# EAGLE design NODEMCU_ESP8266 (EAGLE 7.6.0)
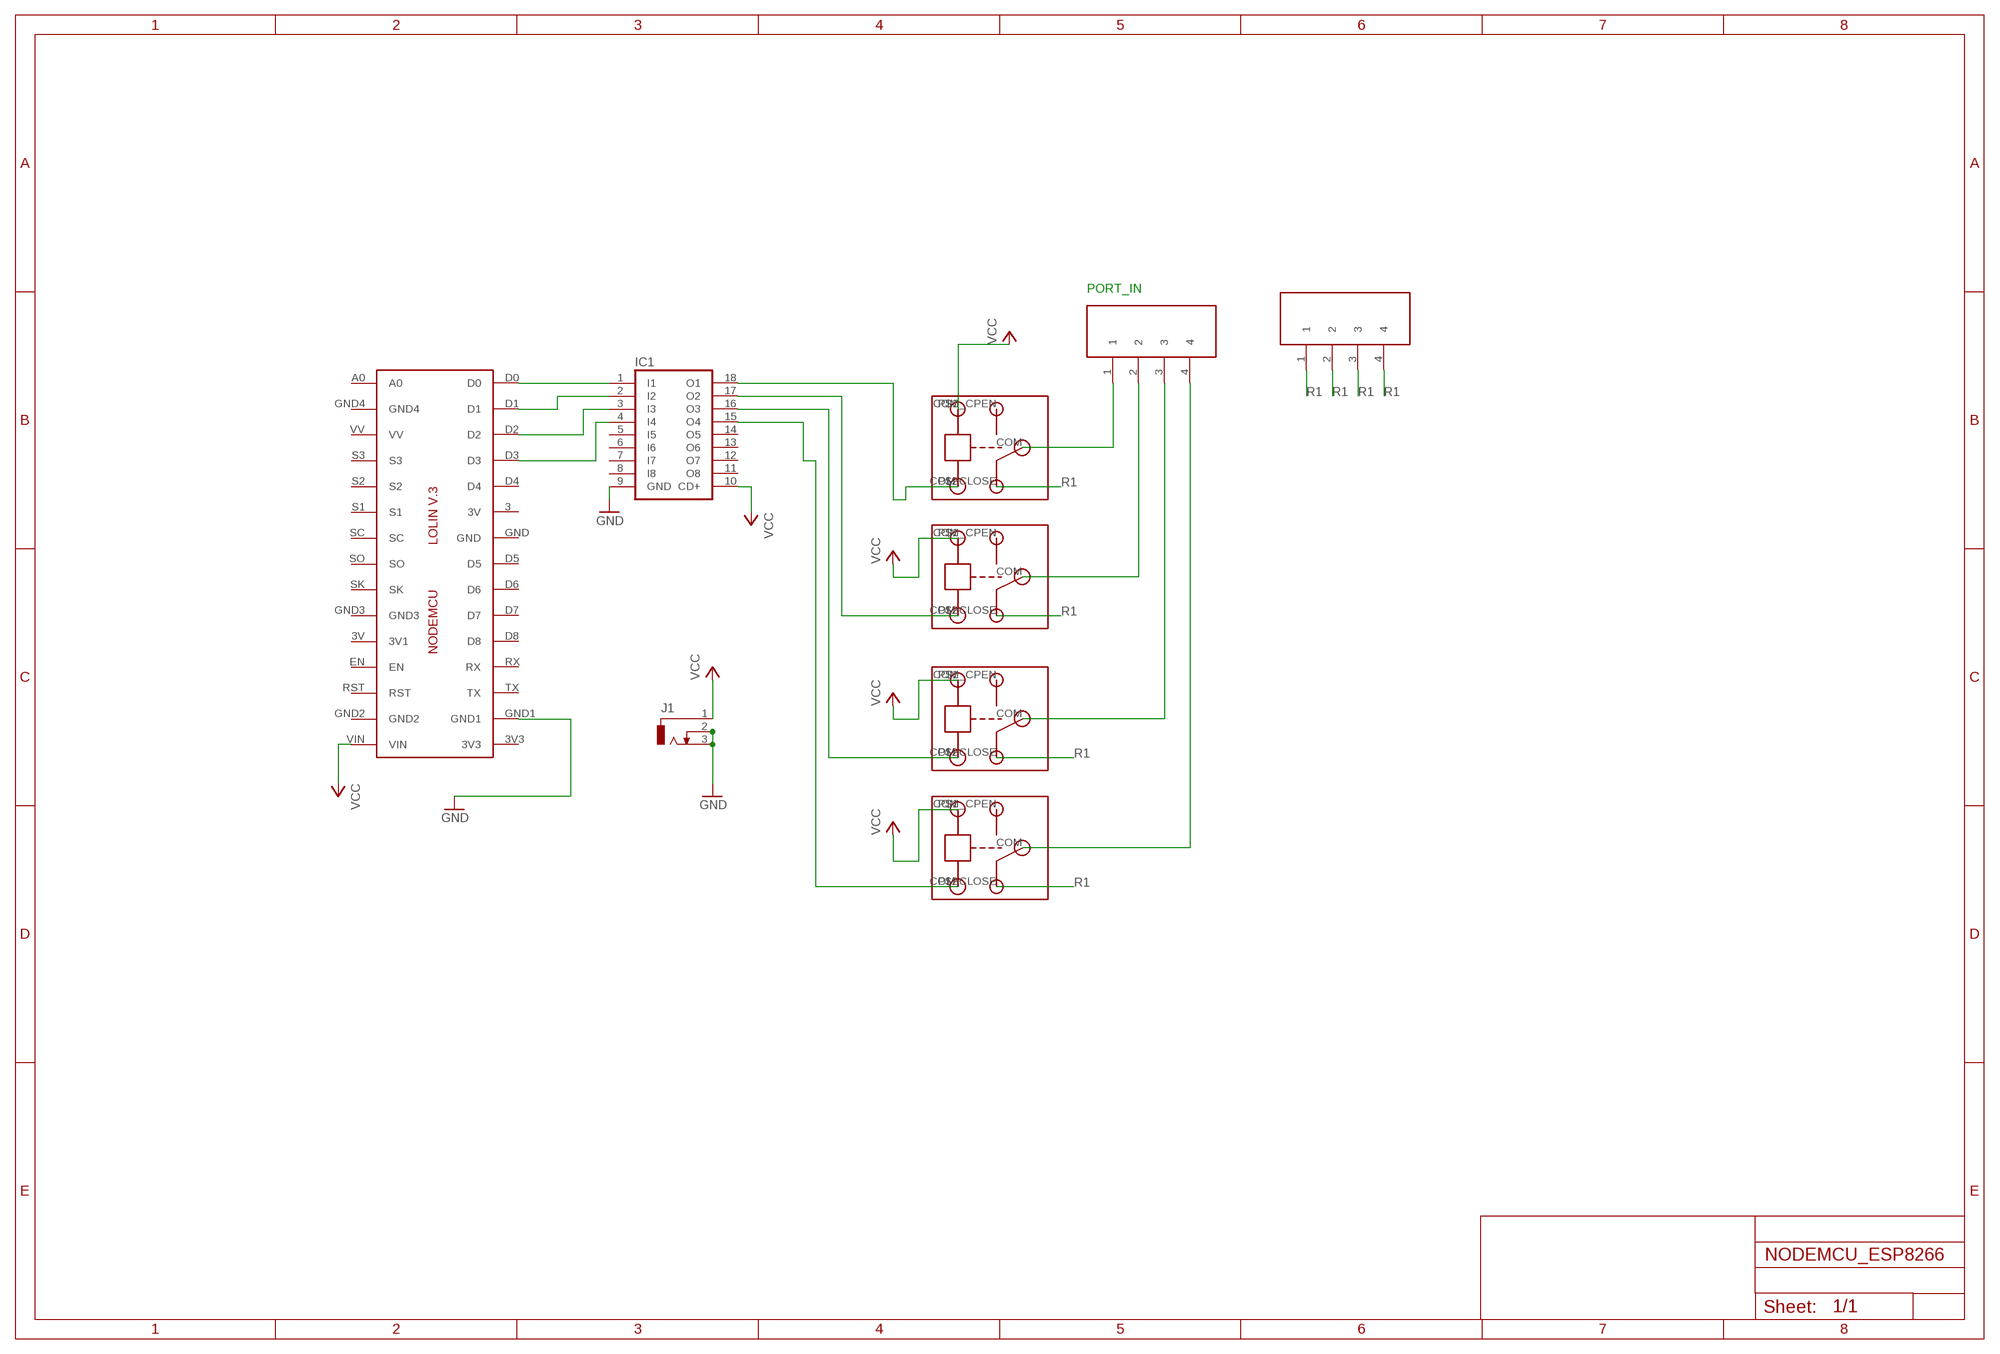
[diagram p0: schematic, sheet 1]

## Parts
IC1  ULN2803A  [DIL18]
IC2  LOLINV3  [LOLINV3]
J1  DCJ0303  [DCJ0303]
PORT_GND  LIB_TERMINAL_4_PORT_9.5MM  [LIB_TERMINAL_4_PORT_9.5MM]
U$2  RELAY  [RELAY]
U$3  RELAY  [RELAY]
U$4  RELAY  [RELAY]
U$5  RELAY  [RELAY]
U$6  LIB_TERMINAL_4_PORT_9.5MM  [LIB_TERMINAL_4_PORT_9.5MM]

## Nets
GND: IC1.9(GND) IC2.GND1 J1.2 J1.3
N$1: IC1.1(I1) IC2.D0
N$2: IC1.2(I2) IC2.D1
N$3: IC1.3(I3) IC2.D2
N$4: IC1.4(I4) IC2.D3
N$5: IC1.18(O1) U$5.P$2(GND)
N$6: IC1.17(O2) U$3.P$2(GND)
N$7: IC1.16(O3) U$2.P$2(GND)
N$8: IC1.15(O4) U$4.P$2(GND)
N$9: U$5.COM U$6.1
N$10: U$3.COM U$6.2
N$11: U$2.COM U$6.3
N$12: U$4.COM U$6.4
R1: PORT_GND.1 PORT_GND.2 PORT_GND.3 PORT_GND.4 U$2.COM-CLOSE U$3.COM-CLOSE U$4.COM-CLOSE U$5.COM-CLOSE
VCC: IC1.10(CD+) IC2.VIN J1.1 U$2.P$1(IN) U$3.P$1(IN) U$4.P$1(IN) U$5.P$1(IN)
Unconnected: IC1.5(I5) IC1.6(I6) IC1.7(I7) IC1.8(I8) IC1.11(O8) IC1.12(O7) IC1.13(O6) IC1.14(O5) IC2.3(3V) IC2.3V3 IC2.3V(3V1) IC2.A0 IC2.D4 IC2.D5 IC2.D6 IC2.D7 IC2.D8 IC2.EN IC2.GND IC2.GND2 IC2.GND3 IC2.GND4 IC2.RST IC2.RX IC2.S1 IC2.S2 IC2.S3 IC2.SC IC2.SK IC2.SO IC2.TX IC2.VV U$2.COM_CPEN(COM-OPEN) U$3.COM_CPEN(COM-OPEN) U$4.COM_CPEN(COM-OPEN) U$5.COM_CPEN(COM-OPEN)

## Notes on the sheet
- PORT_IN

## Library data of the parts
IC1 = uln-udn:ULN2803A: DRIVER ARRAY
IC2 = Lolin:LOLINV3
J1 = con-jack:DCJ0303: DC POWER JACK Source: DCJ0303.pdf; OC_FARNELL: unknown; OC_NEWARK: unknown
PORT_GND U$6 = lib_TERMINAL_4_PORT_9.5MM:LIB_TERMINAL_4_PORT_9.5MM
U$2-U$5 = RELAY:RELAY

## Board
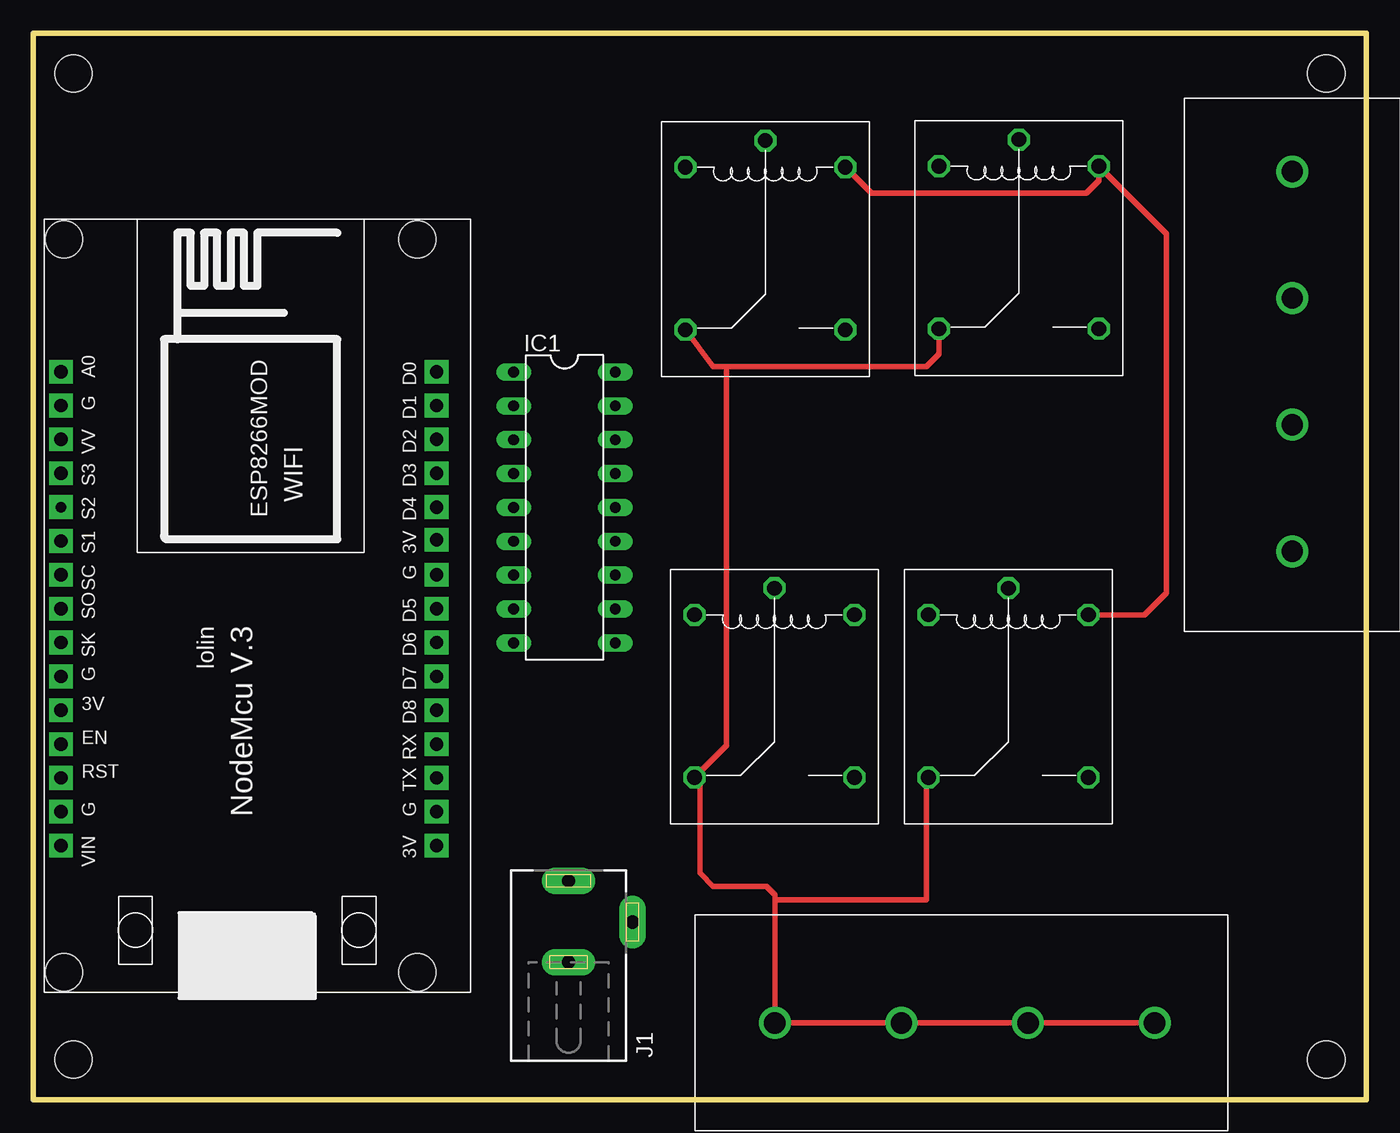
[diagram p1: board, top side]
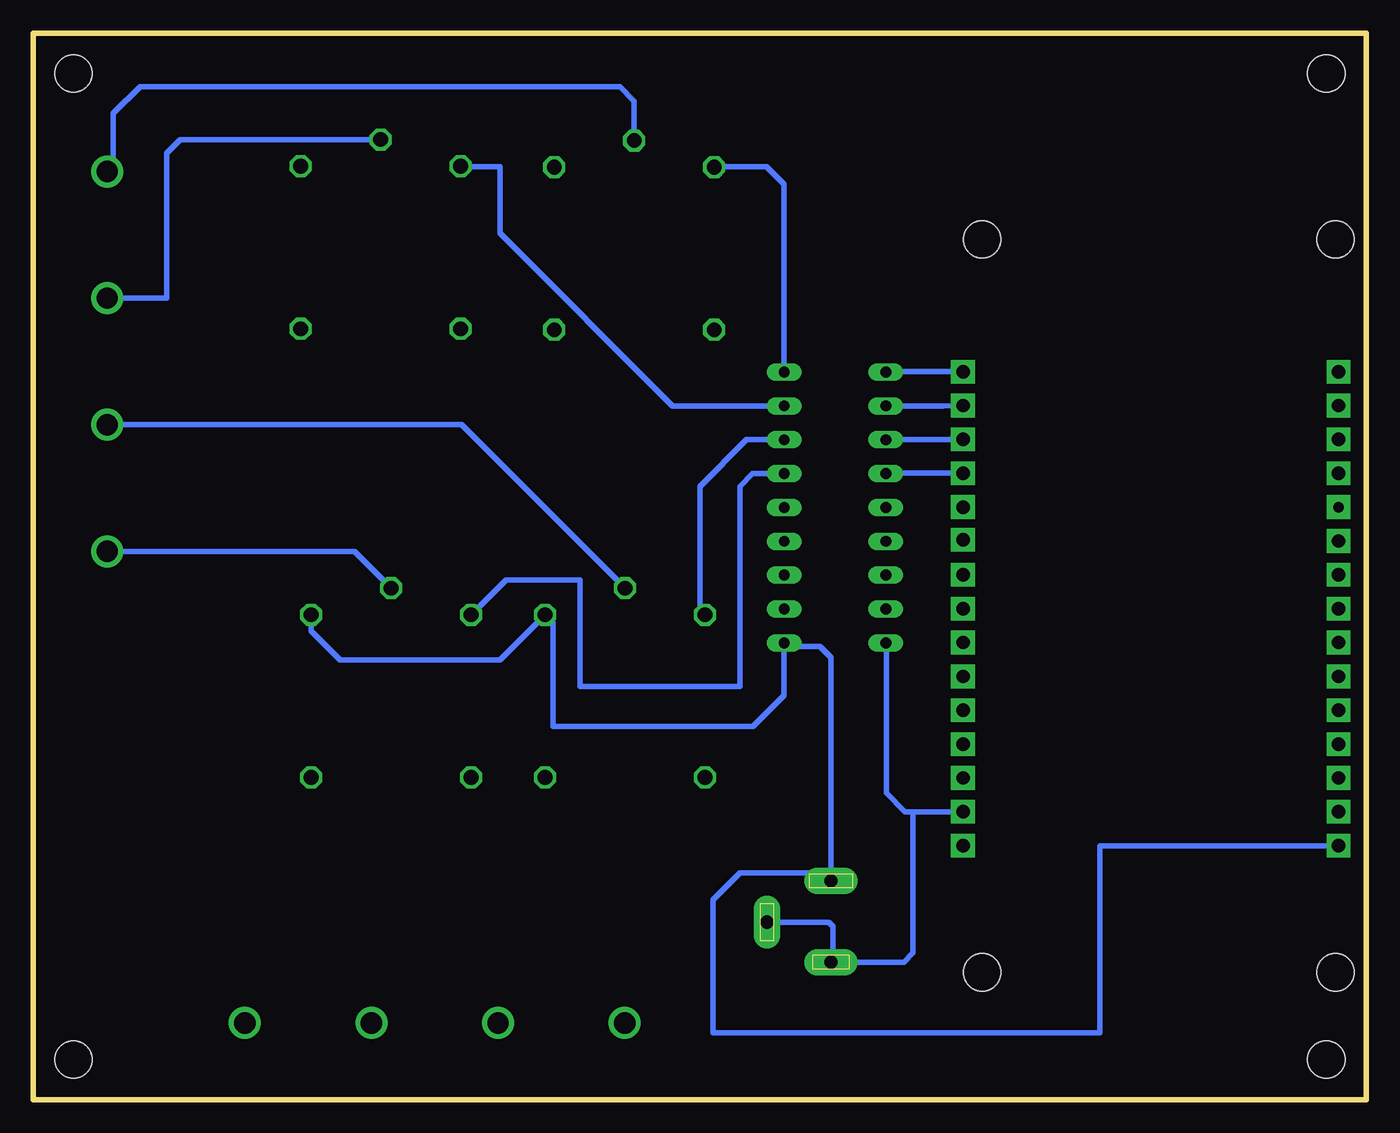
[diagram p2: board, bottom side, seen from below]

Size 100 x 80 mm. Coordinates in mm from the lower left corner, seen from the top.
Outline: 0,0 100,0 100,80 0,80 0,0
Copper layers (1*16): Top 0.035mm / dielectric 1.5mm / Bottom 0.035mm
Design rules "default": minimum track width 10mil, minimum drill 24mil, track to track 8mil, track to pad 8mil, pad to pad 8mil, via to via 8mil, smd to smd 8mil, copper to edge 40mil, drill to drill 8mil, minimum pad ring 10mil, minimum via ring 8mil, stop-mask expansion 4mil, vias tented up to drill 0mil, thermal gap 10mil
Holes 2.8 mm at 3,3 97,3 97,77 3,77
Milling: 4 lines

### Footprints (pad centres in the part's own frame; a part is rotated, then mirrored left to right if it is on the bottom)
DIL18 = drill 0.813 long: 1 -10.16,-3.81; 2 -7.62,-3.81; 3 -5.08,-3.81; 4 -2.54,-3.81; 5 0,-3.81; 6 2.54,-3.81; 7 5.08,-3.81; 8 7.62,-3.81; 9 10.16,-3.81; 10 10.16,3.81; 11 7.62,3.81; 12 5.08,3.81; 13 2.54,3.81; 14 0,3.81; 15 -2.54,3.81; 16 -5.08,3.81; 17 -7.62,3.81; 18 -10.16,3.81
LOLINV3 = drill 1 pad 1.778 square: 3 24.03,29.44; 3V 46.99,29.44; 3V3 36.83,1.27; A0 11.43,1.27; D0 11.43,29.44; D1 13.97,29.44; D2 16.51,29.44; D3 19.05,29.44; D4 21.59,29.44; D5 29.21,29.44; D6 31.75,29.44; D7 34.29,29.44; D8 36.83,29.44; EN 39.37,1.27; GND 26.67,29.44; GND1 44.45,29.44; GND2 44.45,1.27; GND3 34.29,1.27; GND4 13.97,1.27; RST 41.91,1.27; RX 39.37,29.44; S1 24.13,1.27; S3 19.05,1.27; SC 26.67,1.27; SK 31.75,1.27; SO 29.21,1.27; TX 41.91,29.44; VIN 46.99,1.27; VV 16.51,1.27 | drill 0.8 pad 1.778 square: S2 21.59,1.27 | hole 2.8: 56.5,28; 56.5,1.5; 1.5,1.5; 1.5,28
DCJ0303 = drill 1 pad 2 long: 1 0,3.1; 2 4.8,0; 3 0,-3
LIB_TERMINAL_4_PORT_9.5MM = drill 1.6: 1 5.5,8.1; 2 15,8.1; 3 24.5,8.1; 4 34,8.1
RELAY = drill 1.1 octagon: COM -2,0; COM-CLOSE 12.2,-6; COM_CPEN 12.2,6; P$1 0,6; P$2 0,-6

### Placement (x,y rotation side)
IC1  39.85,44.42 270 top
IC2  0.81,66.04 270 top
J1  40.16,13.31 0 top
PORT_GND  89.63,13.84 180 top
U$2  55.6,36.37 270 top
U$3  73.94,70.03 270 top
U$4  73.15,36.37 270 top
U$5  54.91,69.95 270 top
U$6  86.36,75.13 270 top

### Tracks (layer width: path | path; a pad name or v marks a point on that pad's centre or on a via)
GND
  Bottom 0.406: IC2.GND1 34,21.59 | 34,21.59 34.59,21.59 36,23 36,34.22 IC1.9 | J1.2 40.31,13.31 40,13 40,10.47 J1.3 34.69,10.31 34,11 34,21.59
N$1
  Bottom 0.406: IC2.D0 36.04,54.61 IC1.1
N$2
  Bottom 0.406: IC1.2 31.75,52.05 IC2.D1
N$3
  Bottom 0.406: IC2.D2 36.04,49.53 IC1.3
N$4
  Bottom 0.406: IC2.D3 36.04,46.99 IC1.4
N$5
  Bottom 0.406: IC1.18 43.66,68.66 45,70 48.87,70 U$5.P$2
N$6
  Bottom 0.406: IC1.17 52.05,52.05 65,65 65,70 67.91,70 U$3.P$2
N$7
  Bottom 0.406: IC1.16 46.49,49.51 50,46 50,36.77 U$2.P$2
N$8
  Bottom 0.406: IC1.15 46.03,46.97 47,46 47,31 59,31 59,39 64.53,39 U$4.P$2
N$9
  Bottom 0.406: U$5.COM 54.91,74.92 56,76 92,76 94,74 94,70.09 U$6.1
N$10
  Bottom 0.406: U$3.COM 88.97,72.03 90,71 90,60.13 U$6.2
N$11
  Bottom 0.406: U$2.COM 67.86,50.63 U$6.3
N$12
  Bottom 0.406: U$4.COM 75.91,41.13 U$6.4
R1
  Top 0.406: PORT_GND.1 PORT_GND.2 PORT_GND.3 PORT_GND.4 | 55.74,5.75 PORT_GND.4 | U$5.COM-CLOSE 51,55 52,55 | 52,55 67,55 67.94,55.94 U$3.COM-CLOSE | U$2.COM-CLOSE 50,24.57 | 52,55 52,26.57 50,24.57 | 50,24.57 50,17 51,16 55,16 55.63,15.37 55.63,15 | 55.63,15 PORT_GND.4 | U$4.COM-CLOSE 67,24.17 67,15 55.63,15
VCC
  Top 0.406: U$4.P$1 83.37,36.37 85,38 85,64.97 U$3.P$1 79.94,68.94 79,68 62.87,68 U$5.P$1
  Bottom 0.406: J1.1 40.16,17 | 40.16,17 40.16,33.16 41,34 43.4,34 IC1.10 43.66,30.34 46,28 61,28 61,35.77 U$2.P$1 64.97,33 77,33 79.15,35.15 U$4.P$1 | IC2.VIN 19.95,19.05 20,19 20,5 49,5 49,15 47,17 40.16,17